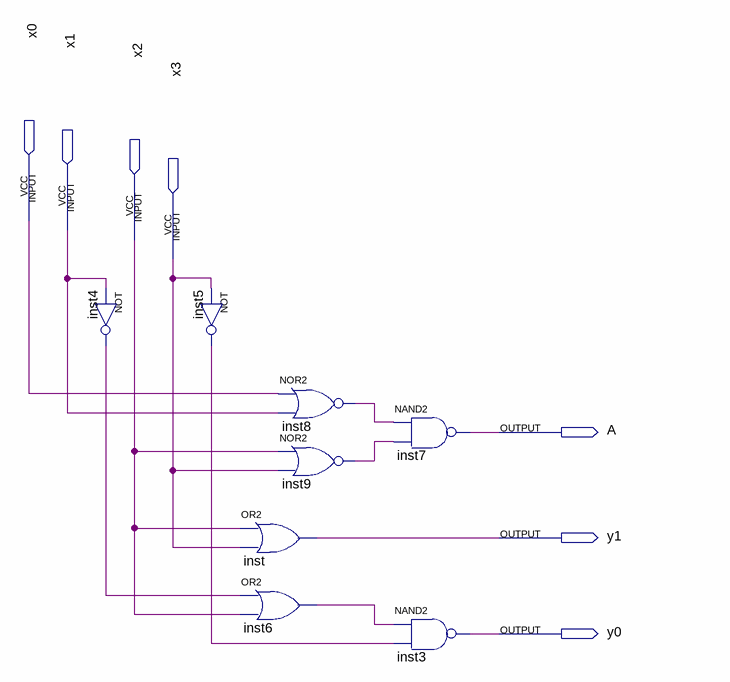
[diagram p0: schematic sheet]
// Quartus schematic Problema4.bdf as structural Verilog: 8 symbols, 7 pins
module Problema4 (
  input  x0,
  input  x1,
  input  x2,
  input  x3,
  output A,
  output y1,
  output y0
);

  wire inst4_out, inst5_out, inst6_out, inst8_out, inst9_out;

  not inst4 (inst4_out, x1);
  not inst5 (inst5_out, x3);
  nor inst8 (inst8_out, x0, x1);
  nor inst9 (inst9_out, x2, x3);
  or inst (y1, x2, x3);
  or inst6 (inst6_out, inst4_out, x2);
  nand inst7 (A, inst8_out, inst9_out);
  nand inst3 (y0, inst6_out, inst5_out);
endmodule
